# Altium schematic sheet klokun-custom-el.SchDoc
size A4
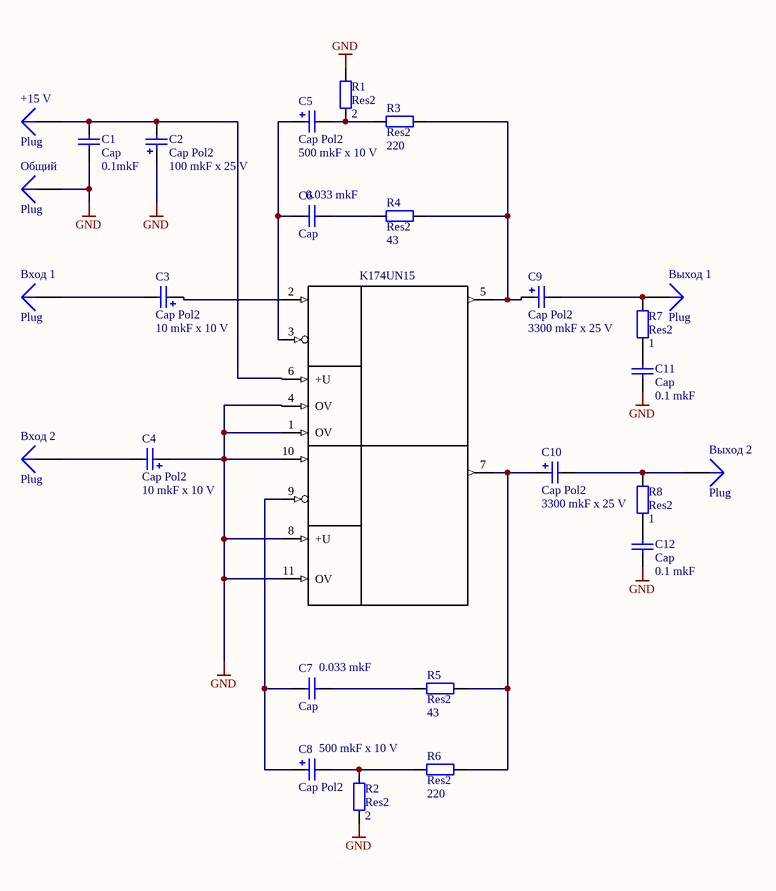
[diagram p0: klokun-custom-el.SchDoc]

## Parts
+15_V  Plug  [PIN1]
C1  Cap  value 0.1mkF  [RAD-0.3]
C2  Cap Pol2  value 100 mkF x 25 V  [POLAR0.8]
C3  Cap Pol2  value 10 mkF x 10 V  [POLAR0.8]
C4  Cap Pol2  value 10 mkF x 10 V  [POLAR0.8]
C5  Cap Pol2  value 500 mkF x 10 V  [POLAR0.8]
C6  Cap  value 0.033 mkF  [RAD-0.3]
C7  Cap  value 0.033 mkF  [RAD-0.3]
C8  Cap Pol2  value 500 mkF x 10 V  [POLAR0.8]
C9  Cap Pol2  value 3300 mkF x 25 V  [POLAR0.8]
C10  Cap Pol2  value 3300 mkF x 25 V  [POLAR0.8]
C11  Cap  value 0.1 mkF  [RAD-0.3]
C12  Cap  value 0.1 mkF  [RAD-0.3]
DA1  K174UN15
R1  Res2  value 2  [AXIAL-0.4]
R2  Res2  value 2  [AXIAL-0.4]
R3  Res2  value 220  [AXIAL-0.4]
R4  Res2  value 43  [AXIAL-0.4]
R5  Res2  value 43  [AXIAL-0.4]
R6  Res2  value 220  [AXIAL-0.4]
R7  Res2  value 1  [AXIAL-0.4]
R8  Res2  value 1  [AXIAL-0.4]
Вход_1  Plug  [PIN1]
Вход_2  Plug  [PIN1]
Выход_1  Plug  [PIN1]
Выход_2  Plug  [PIN1]
Общий  Plug  [PIN1]

## Nets
GND: C1.1 C2.1 C4.1 C11.1 C12.1 DA1.1(OV) DA1.4(OV) DA1.8(+U) DA1.10 DA1.11(OV) R1.2 R2.1 Общий.1
Net+15_V_1: +15_V.1 C1.2 C2.2 DA1.6(+U)
NetC3_1: C3.1 DA1.2
NetC3_2: C3.2 Вход_1.1
NetC4_2: C4.2 Вход_2.1
NetC5_1: C5.1 C6.1 DA1.3
NetC5_2: C5.2 R1.1 R3.1
NetC6_2: C6.2 R4.1
NetC7_1: C7.1 C8.1 DA1.9
NetC7_2: C7.2 R5.1
NetC8_2: C8.2 R2.2 R6.1
NetC9_1: C9.1 DA1.5 R3.2 R4.2
NetC9_2: C9.2 R7.2 Выход_1.1
NetC10_1: C10.1 DA1.7 R5.2 R6.2
NetC10_2: C10.2 R8.2 Выход_2.1
NetC11_2: C11.2 R7.1
NetC12_2: C12.2 R8.1

## Library data of the parts
C1 C6 C7 C11 C12 = Cap: Capacitor; Published: 8-Jun-2000; LatestRevisionDate: 17-Jul-2002; LatestRevisionNote: Re-released for DXP Platform.; PackageReference: RAD-0.3; Publisher: Altium Limited
C2-C5 C8-C10 = Cap Pol2: Polarized Capacitor (Axial); Published: 8-Jun-2000; LatestRevisionDate: 17-Jul-2002; LatestRevisionNote: Re-released for DXP Platform.; PackageReference: POLAR0.8; Publisher: Altium Limited
R1-R8 = Res2: Resistor; Published: 8-Jun-2000; LatestRevisionDate: 17-Jul-2002; LatestRevisionNote: Re-released for DXP Platform.; PackageReference: AXIAL-0.4; Publisher: Altium Limited
+15_V Вход_1 Вход_2 Выход_1 Выход_2 Общий = Plug: LatestRevisionDate: 17-Jul-2002; LatestRevisionNote: Re-released for DXP Platform.; Publisher: Altium Limited
DA1 = K174UN15: ComponentName: K174UN15